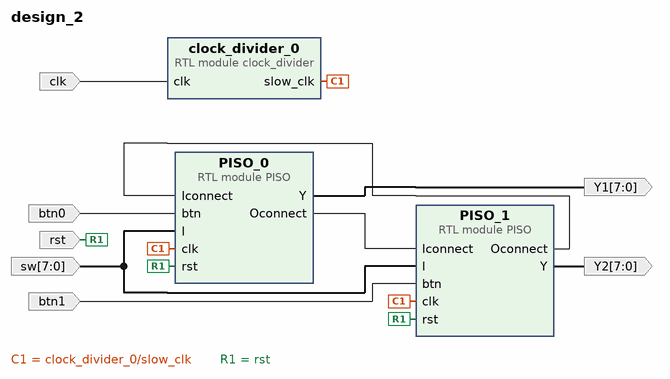
[diagram p0: block diagram of the top level]
# Vivado block design design_2, xc7z007sclg400-1, Vivado 2024.1.1
create_bd_design design_2

create_bd_port -dir I -from 7 -to 0 sw
create_bd_port -dir I clk
create_bd_port -dir I rst
create_bd_port -dir I btn0
create_bd_port -dir I btn1
create_bd_port -dir O -from 7 -to 0 Y2
create_bd_port -dir O -from 7 -to 0 Y1

create_bd_cell -type module -reference PISO PISO_0
create_bd_cell -type module -reference PISO PISO_1
create_bd_cell -type module -reference clock_divider clock_divider_0

# ---- connections ----

connect_bd_net [get_bd_pins PISO_0/Oconnect] [get_bd_pins PISO_1/Iconnect]
connect_bd_net [get_bd_pins PISO_0/Y] [get_bd_ports Y1]
connect_bd_net [get_bd_pins PISO_1/Oconnect] [get_bd_pins PISO_0/Iconnect]
connect_bd_net [get_bd_pins PISO_1/Y] [get_bd_ports Y2]
connect_bd_net -net btn0_1 [get_bd_ports btn0] [get_bd_pins PISO_0/btn]
connect_bd_net -net btn1_1 [get_bd_ports btn1] [get_bd_pins PISO_1/btn]
connect_bd_net [get_bd_ports clk] [get_bd_pins clock_divider_0/clk]
connect_bd_net [get_bd_pins clock_divider_0/slow_clk] [get_bd_pins PISO_0/clk] [get_bd_pins PISO_1/clk]
connect_bd_net [get_bd_ports rst] [get_bd_pins PISO_0/rst] [get_bd_pins PISO_1/rst]
connect_bd_net [get_bd_ports sw] [get_bd_pins PISO_0/I] [get_bd_pins PISO_1/I]

validate_bd_design
save_bd_design
